# Altium schematic sheet Sheet1.SchDoc
size A
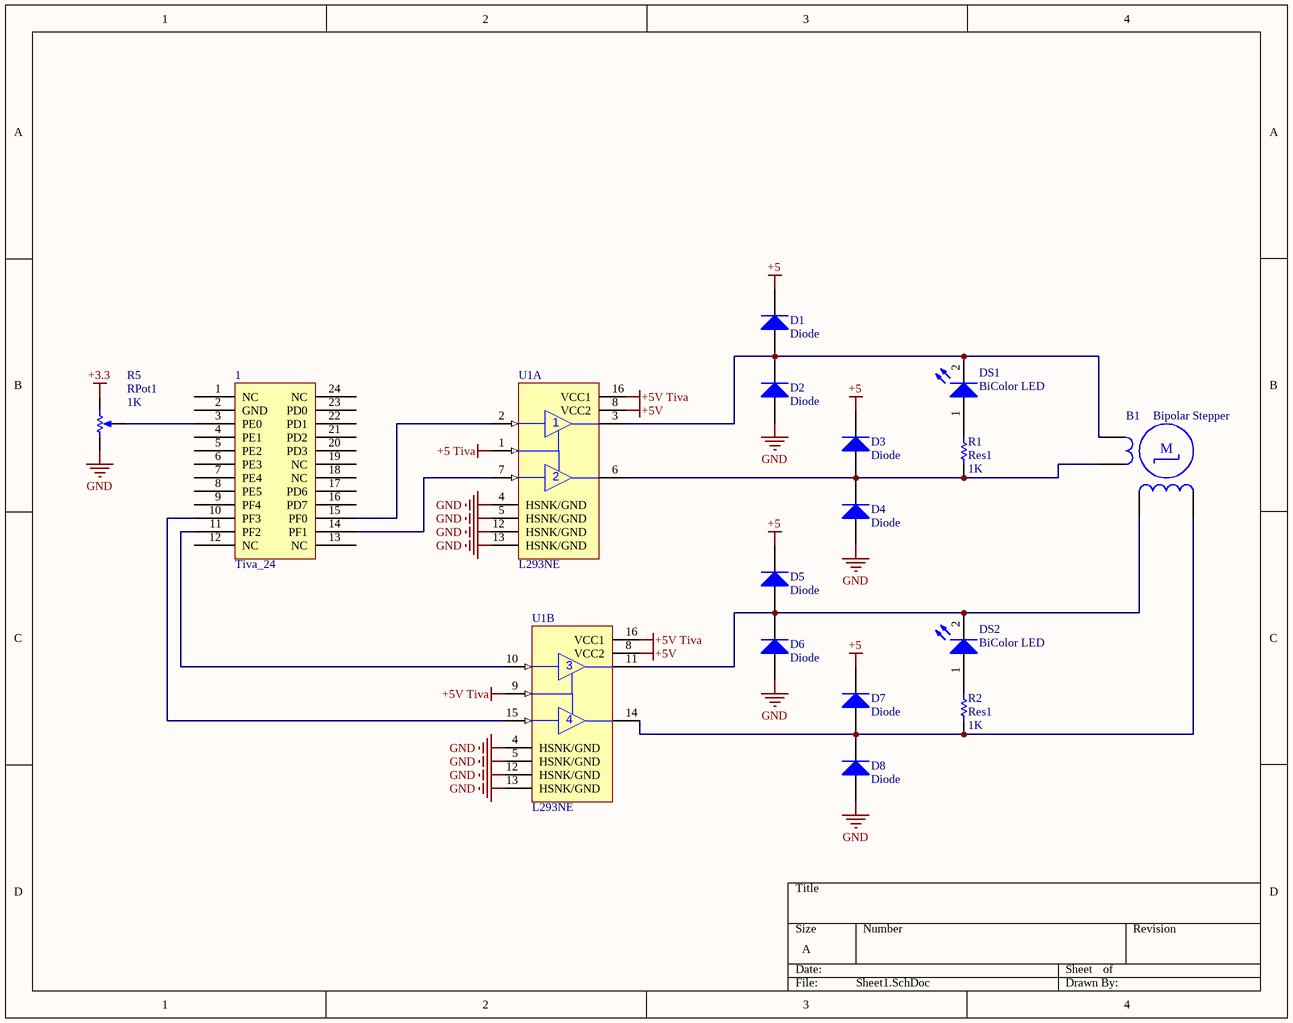
[diagram p0: Sheet1.SchDoc]

## Parts
1  Tiva_24
B1  Bipolar Stepper  [DIP-6]
D1  Diode  [DSO-C2/X3.3]
D2  Diode  [DSO-C2/X3.3]
D3  Diode  [DSO-C2/X3.3]
D4  Diode  [DSO-C2/X3.3]
D5  Diode  [DSO-C2/X3.3]
D6  Diode  [DSO-C2/X3.3]
D7  Diode  [DSO-C2/X3.3]
D8  Diode  [DSO-C2/X3.3]
DS1  BiColor LED  [LED-0]
DS2  BiColor LED  [LED-0]
R1  Res1  value 1K  [AXIAL-0.3]
R2  Res1  value 1K  [AXIAL-0.3]
R5  RPot1  value 1K  [VR5]
U1  L293NE  [DIP-16/X1.5]  (parts A,B of 2)

## Nets
+3.3: R5.2(BOT)
+5: D1.2(K) D3.2(K) D5.2(K) D7.2(K)
+5 Tiva: U1.1(1,2EN)
+5V: U1.8(VCC2)
+5V Tiva: U1.9(3,4EN) U1.16(VCC1)
GND: D2.1(A) D4.1(A) D6.1(A) D8.1(A) R5.1(TOP) U1.4(HSNK/GND) U1.5(HSNK/GND) U1.12(HSNK/GND) U1.13(HSNK/GND)
Net1_3: 1.3(PE0) R5.3(TAP)
Net1_10: 1.10(PF3) U1.15(4A)
Net1_11: 1.11(PF2) U1.10(3A)
Net1_14: 1.14(PF1) U1.7(2A)
Net1_15: 1.15(PF0) U1.2(1A)
NetB1_1: B1.1 D1.1(A) D2.2(K) DS1.2(K) U1.3(1Y)
NetB1_3: B1.3 D3.1(A) D4.2(K) R1.1 U1.6(2Y)
NetB1_4: B1.4 D5.1(A) D6.2(K) DS2.2(K) U1.11(3Y)
NetB1_6: B1.6 D7.1(A) D8.2(K) R2.1 U1.14(4Y)
NetDS1_1: DS1.1(A) R1.2
NetDS2_1: DS2.1(A) R2.2

Not connected (* = marked no-connect by the designer): 1 1(NC) 2(GND) 4(PE1) 5(PE2) 6(PE3) 7(PE4) 8(PE5) 9(PF4) 12(NC) 13(NC) 16(PD7) 17(PD6) 18(NC) 19(NC) 20(PD3) 21(PD2) 22(PD1) 23(PD0) 24(NC)

## Notes on the sheet
- (in symbol Motor Step 4Wire) M

## Library data of the parts
1 = Tiva_24: Tiva Protection 24 Pin Connector
B1 = Motor Step 4Wire: Motor Stepper; Manufacturer: Generic Components; Published: 1999
D1-D8 = Diode: Default Diode; Manufacturer: Generic Components; Class: Discrete; SubClass: Diode - Switching; Published: 08/06/2000; Publisher: Altium Hobart Technology Centre
DS1 DS2 = LED0: Typical INFRARED GaAs LED; Manufacturer: Generic Components; Class: Optoelectronic; Published: 08/06/2000; Publisher: Altium Hobart Technology Centre; SubClass: LED
R1 R2 = Res1: Resistor; Manufacturer: Generic Components; Class: Passive; Published: 08/06/2000; Publisher: Altium Hobart Technology Centre; SubClass: Resistor
R5 = RPot1: Potentiometer; Manufacturer: Generic Components; Class: Passive; Set Position: 0.5; Published: 08/06/2000; Publisher: Altium Hobart Technology Centre; SubClass: Potentiometer
U1 = L293NE: Quadruple Half-H Driver; Manufacturer: Texas Instruments; Class: Interface; SubClass: Peripheral Driver; Published: 15/05/2002; Publisher: Altium Hobart Technology Centre